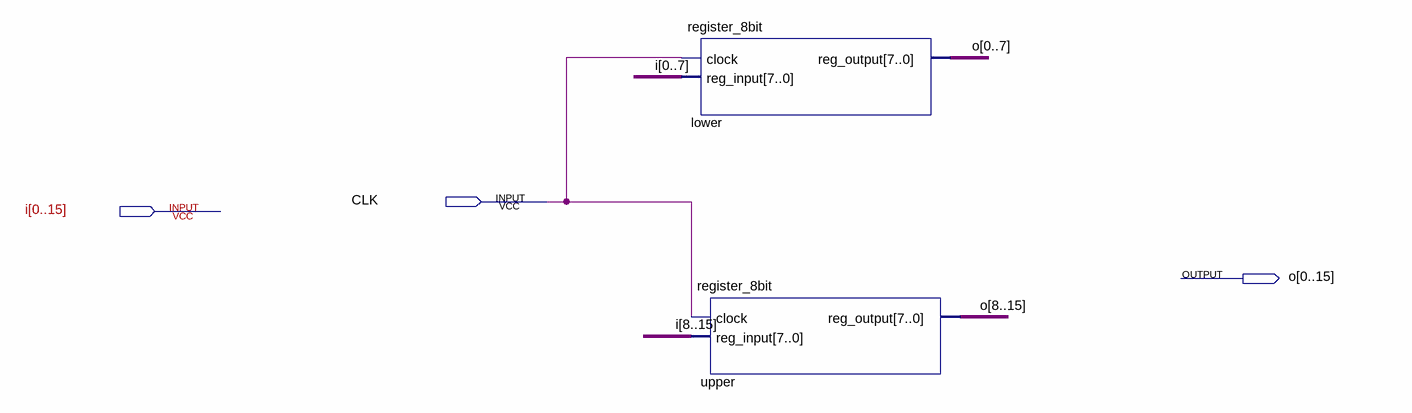
[diagram p0: schematic sheet]
// Quartus schematic register_2bit.bdf as structural Verilog: 2 symbols, 3 pins
module register_2bit (
  input  CLK,
  input  [0:15] i,
  output [0:15] o
);

  register_8bit lower (.clock(CLK), .reg_input(i[0:7]), .reg_output(o[0:7]));
  register_8bit upper (.clock(CLK), .reg_input(i[8:15]), .reg_output(o[8:15]));
endmodule
